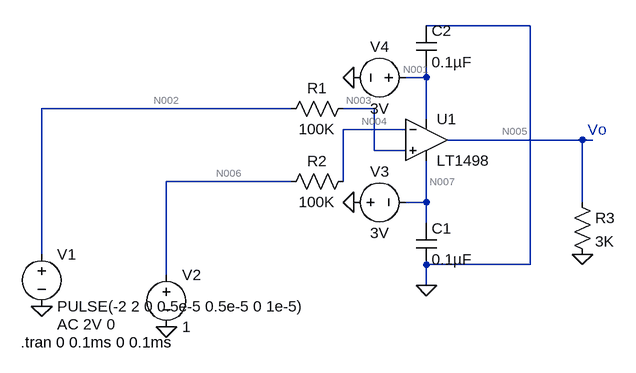
[diagram p0: schematic BENCH.asc]
BENCH.asc, the LTspice schematic file:
Version 4
SHEET 1 1384 680
WIRE 784 -176 624 -176
WIRE 624 -96 624 -112
WIRE 624 -96 592 -96
WIRE 416 -48 32 -48
WIRE 544 -48 496 -48
WIRE 624 -32 624 -96
WIRE 592 -16 496 -16
WIRE 864 0 656 0
WIRE 880 0 864 0
WIRE 544 16 544 -48
WIRE 592 16 544 16
WIRE 416 64 224 64
WIRE 496 64 496 -16
WIRE 624 96 624 32
WIRE 624 96 592 96
WIRE 864 96 864 0
WIRE 624 128 624 96
WIRE 32 176 32 -48
WIRE 784 192 784 -176
WIRE 784 192 624 192
WIRE 224 208 224 64
WIRE 624 224 624 192
FLAG 224 288 0
FLAG 32 256 0
FLAG 864 176 0
FLAG 624 224 0
FLAG 512 -96 0
FLAG 512 96 0
SYMBOL res 512 -64 R90
WINDOW 0 0 56 VBottom 2
WINDOW 3 32 56 VTop 2
SYMATTR InstName R1
SYMATTR Value 100K
SYMBOL res 512 48 R90
WINDOW 0 0 56 VBottom 2
WINDOW 3 32 56 VTop 2
SYMATTR InstName R2
SYMATTR Value 100K
SYMBOL res 848 80 R0
SYMATTR InstName R3
SYMATTR Value 3K
SYMBOL voltage 32 160 R0
WINDOW 123 24 124 Left 2
WINDOW 39 0 0 Left 0
SYMATTR Value2 AC 2V 0
SYMATTR InstName V1
SYMATTR Value PULSE(-2 2 0 0.5e-5 0.5e-5 0 1e-5)
SYMBOL voltage 224 192 R0
WINDOW 123 0 0 Left 0
WINDOW 39 0 0 Left 0
SYMATTR InstName V2
SYMATTR Value 1
SYMBOL cap 608 128 R0
SYMATTR InstName C1
SYMATTR Value 0.1µF
SYMBOL cap 608 -176 R0
SYMATTR InstName C2
SYMATTR Value 0.1µF
SYMBOL voltage 608 -96 R90
WINDOW 0 -32 56 VBottom 2
WINDOW 3 32 56 VTop 2
WINDOW 123 0 0 Left 0
WINDOW 39 0 0 Left 0
SYMATTR InstName V4
SYMATTR Value 3V
SYMBOL voltage 496 96 R270
WINDOW 0 32 56 VTop 2
WINDOW 3 -32 56 VBottom 2
WINDOW 123 0 0 Left 0
WINDOW 39 0 0 Left 0
SYMATTR InstName V3
SYMATTR Value 3V
SYMBOL OpAmps\\LT1498 624 -64 R0
SYMATTR InstName U1
TEXT 0 312 Left 2 !.tran 0 0.1ms 0 0.1ms
TEXT 872 -16 Left 2 ;Vo

The netlist it stands for:
* BENCH.asc
R1 N003 N002 100K
R2 N004 N006 100K
R3 N005 0 3K
V1 N002 0 PULSE(-2 2 0 0.5e-5 0.5e-5 0 1e-5) AC 2V 0
V2 N006 0 1
C1 N007 0 0.1µF
C2 0 N001 0.1µF
V4 N001 0 3V
V3 0 N007 3V
XU1 N003 N004 N001 N007 N005 LT1498  ; pins In+ In- V+ V- OUT
.tran 0 0.1ms 0 0.1ms
* Vo
.lib LTC.lib
.backanno
.end

* Results of the author's LTspice run, read from the files saved beside the schematic
* Operating Point, zero values left out:
*   V(n003) = -895.7 mV
*   V(n002) = -2 V
*   V(n004) = -54.13 mV
*   V(n006) = 1 V
*   V(n005) = -2.972 V
*   V(n007) = -3 V
*   V(n001) = 3 V
*   I(R3) = -990.6 µA
*   I(R2) = -10.54 µA
*   I(R1) = 11.04 µA
*   I(V3) = -1.682 mA
*   I(V4) = -691.8 µA
*   I(V2) = -10.54 µA
*   I(V1) = 11.04 µA
*   Ix(u1:1) = -11.04 µA
*   Ix(u1:2) = 10.54 µA
*   Ix(u1:3) = 691.8 µA
*   Ix(u1:4) = -1.682 mA
*   Ix(u1:5) = 990.6 µA
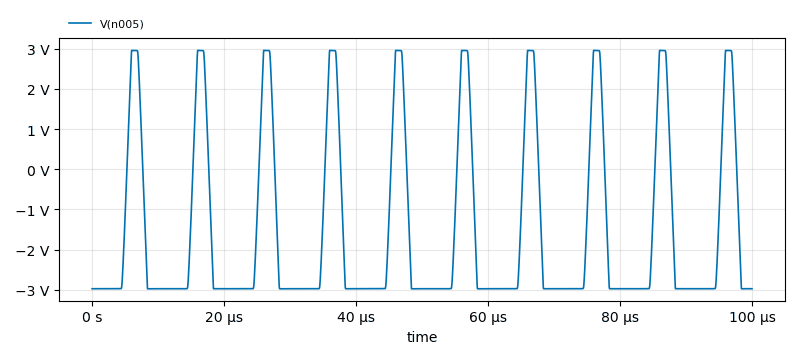
[diagram p1: Transient Analysis of BENCH.asc, plotted from the saved traces]
* Transient Analysis, 1 run:
*   V(n005): min -2.974 V, max 2.959 V, average -1.544 V, rms 2.677 V, last -2.972 V